# EAGLE design Dyno CAN Backplane (EAGLE 5.12)
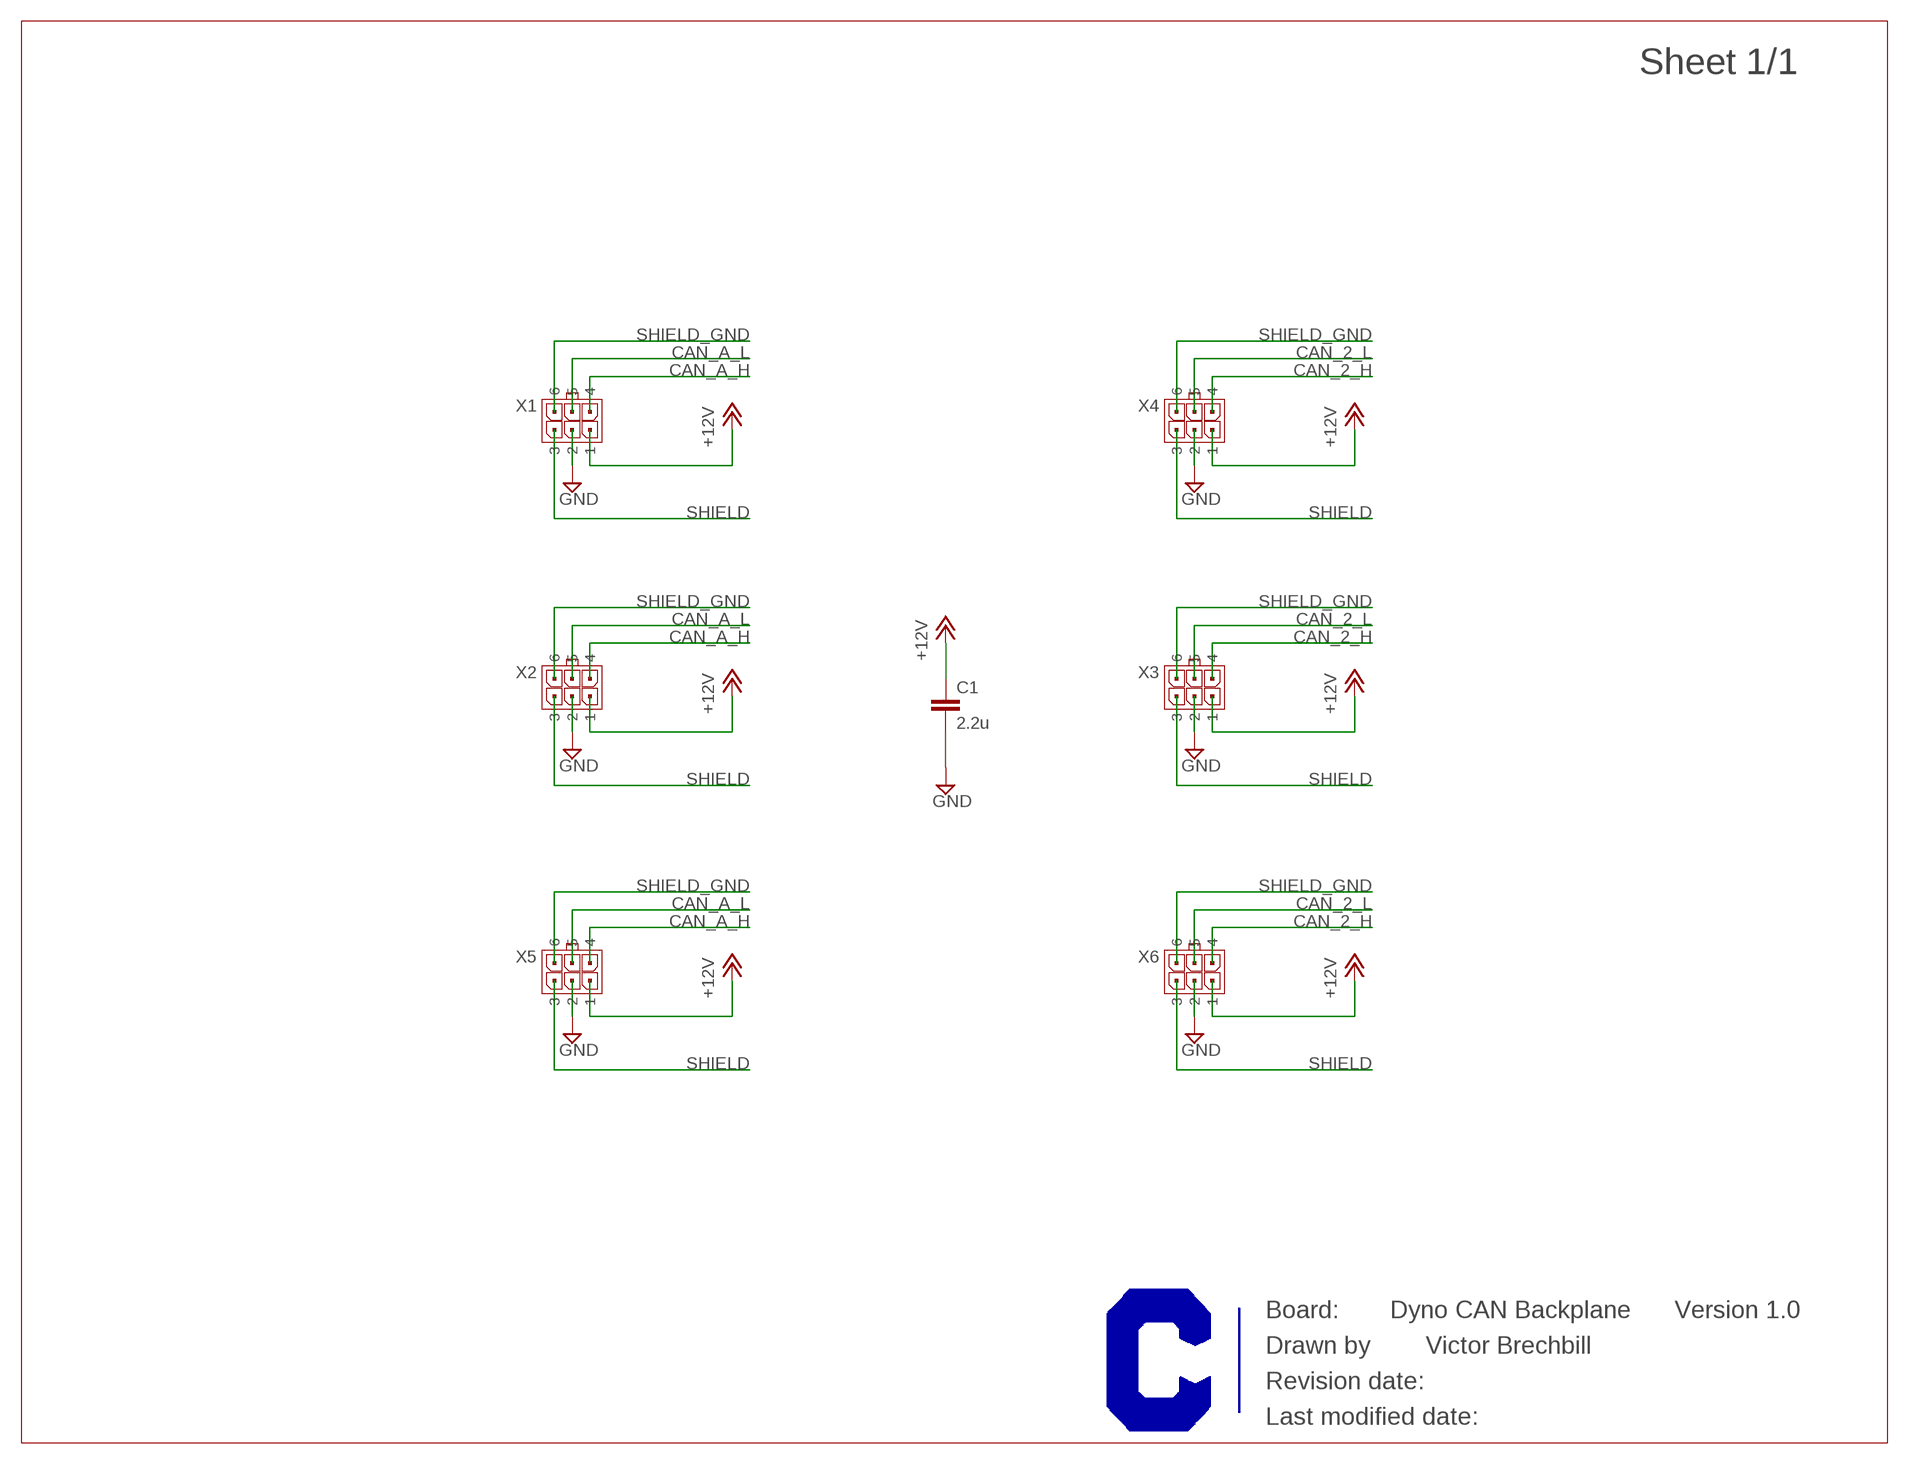
[diagram p0: schematic, sheet 1]

## Parts
C1  2.2u  CAP0603-CAP  [0603-CAP]
U$1  CURRENT-C-LETTER-LANDSCAPE  [BLANK]
X1  MICROFIT-06-DUAL-RA-SMD  [MICROFIT-6-DUAL-RA-SMD]
X2  MICROFIT-06-DUAL-RA-SMD  [MICROFIT-6-DUAL-RA-SMD]
X3  MICROFIT-06-DUAL-RA-SMD  [MICROFIT-6-DUAL-RA-SMD]
X4  MICROFIT-06-DUAL-RA-SMD  [MICROFIT-6-DUAL-RA-SMD]
X5  MICROFIT-06-DUAL-RA-SMD  [MICROFIT-6-DUAL-RA-SMD]
X6  MICROFIT-06-DUAL-RA-SMD  [MICROFIT-6-DUAL-RA-SMD]

## Nets
+12V: C1.1 X1.1 X2.1 X3.1 X4.1 X5.1 X6.1
CAN_2_H: X3.4 X4.4 X6.4
CAN_2_L: X3.5 X4.5 X6.5
CAN_A_H: X1.4 X2.4 X5.4
CAN_A_L: X1.5 X2.5 X5.5
GND: C1.2 X1.2 X1.6 X2.2 X2.6 X3.2 X3.6 X4.2 X4.6 X5.2 X5.6 X6.2 X6.6
SHIELD: X1.3 X2.3 X3.3 X4.3 X5.3 X6.3

## Notes on the sheet
- SHIELD_GND | SHIELD_GND
- SHIELD_GND | SHIELD_GND
- SHIELD_GND | SHIELD_GND
- Dyno CAN Backplane | Version 1.0
- Victor Brechbill

## Library data of the parts
C1 = SparkFun:CAP: Capacitor Standard 0603 ceramic capacitor, and 0.1" leaded capacitor.
U$1 = Frames:CURRENT-C-LETTER-LANDSCAPE; BOM: EXCLUDE
X1-X6 = Molex:MICROFIT-06-DUAL: Molex MicroFit 3.00mm Pitch Header, Surface Mount, Dual Row, 6 Circuits Note, November 2014: These come in three styles: Through-hole, with metal clip retention to PCB (not currently represented) (cheapest) SMD, with solder tab retention (-SMD) (more expensive, commonly stocked) SMD, with metal clip retention (-SMD-CLIP_RETENTION) (most expensive, not often stocked) Please use them in that order! Drawing: http://www.molex.com/pdm_docs/sd/430450609_sd.pdf (right-angle) Information: http://www.molex.com/molex/products/datasheet.jsp?part=active/0430450618_PCB_HEADERS.xml; PARTNO: 43045-0609

## Board
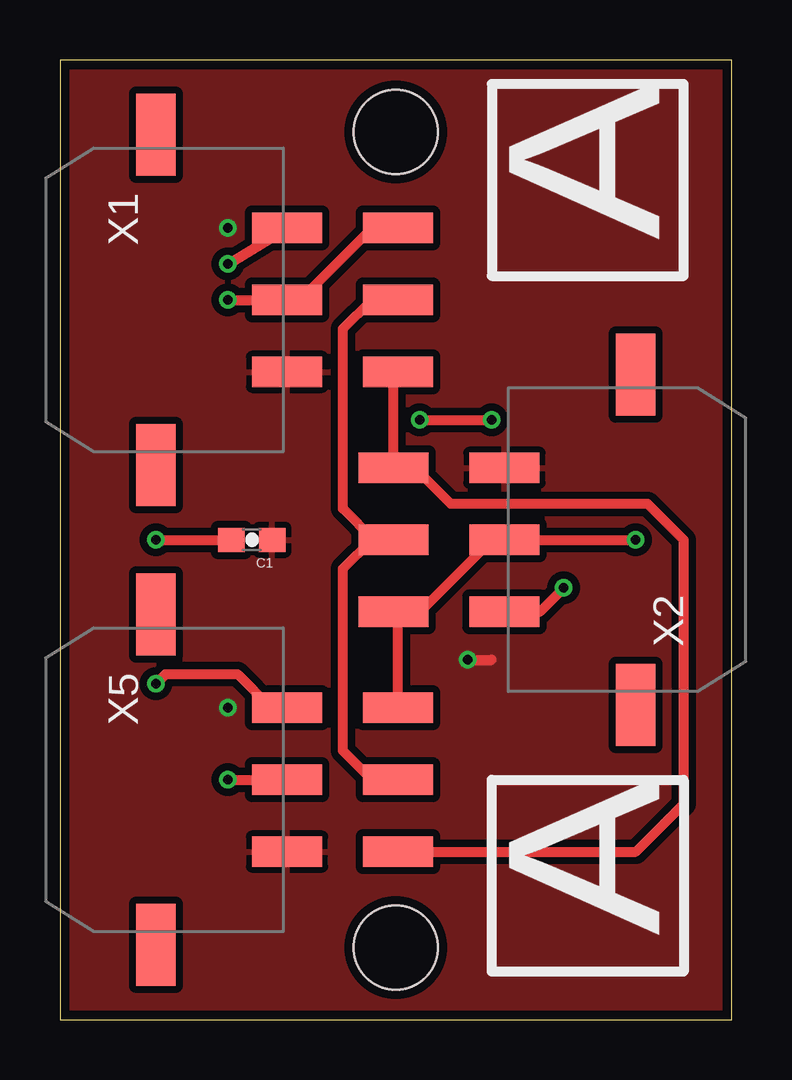
[diagram p1: board, top side]
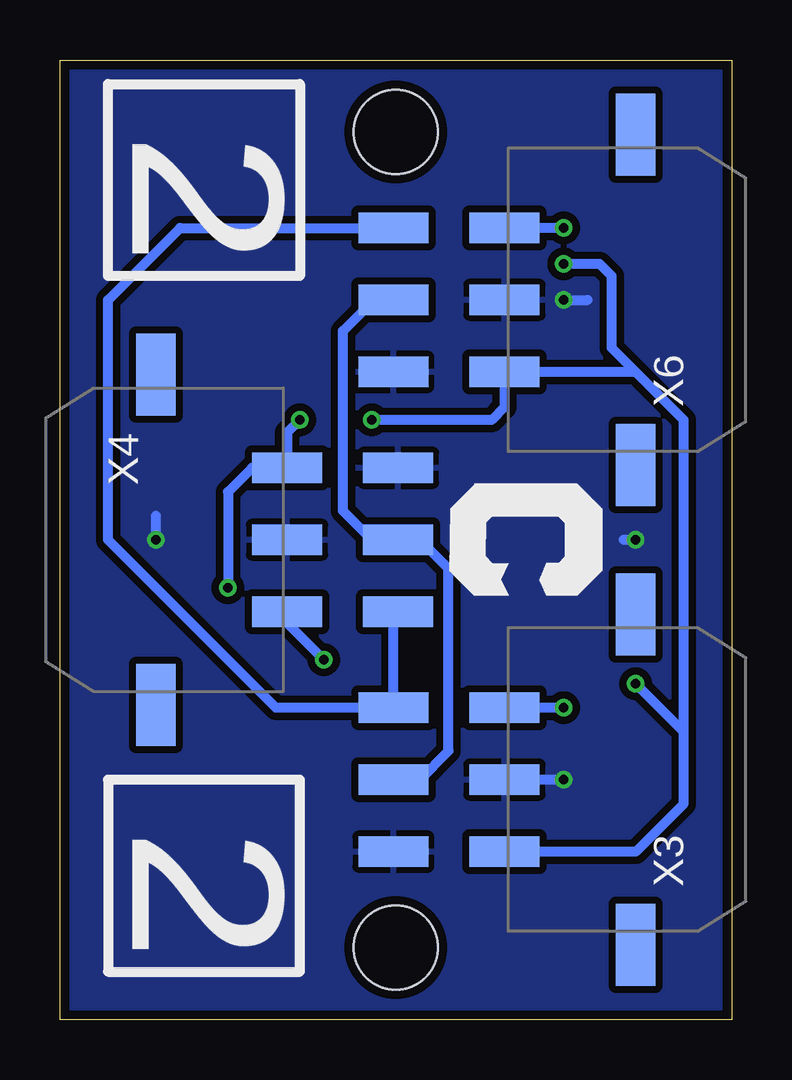
[diagram p2: board, bottom side, seen from below]

Size 28 x 40 mm. Coordinates in mm from the lower left corner, seen from the top.
Outline: 0,0 28,0 28,40 0,40 0,0
Copper layers (1*16): Top 0.0356mm / dielectric 1.5011mm / Bottom 0.0356mm
Design rules "OSH Park 2-layer": minimum track width 6mil, minimum drill 13mil, track to track 6mil, track to pad 6mil, pad to pad 6mil, via to via 6mil, smd to smd 6mil, copper to edge 15mil, drill to drill 6mil, minimum pad ring 7mil, minimum via ring 7mil, stop-mask expansion 4mil, vias tented up to drill 0mil, thermal gap 10mil
Holes 3.5 mm at 14,3 14,37

### Footprints (pad centres in the part's own frame; a part is rotated, then mirrored left to right if it is on the bottom)
0603-CAP = smd 1.1 x 1: 1 -0.85,0; 2 0.85,0
MICROFIT-6-DUAL-RA-SMD = smd 1.27 x 2.921: 1 3,5.47; 2 0,5.47; 3 -3,5.47; 4 3,10.1; 5 0,10.1; 6 -3,10.1 | smd 3.429 x 1.651: P$9 6.883,0; P$10 -6.883,0

### Placement (x,y rotation side)
C1  8,20 180 top
U$1  -54.61,35.56 0 top  (outside the outline)
X1  4,30 270 top
X2  24,20 90 top
X3  4,10 90 bottom
X4  24,20 270 bottom
X5  4,10 270 top
X6  4,30 90 bottom

### Tracks (layer width: path | path; a pad name or v marks a point on that pad's centre or on a via)
+12V  (via drill 0.38)
  Top 0.406: v17,15 18,15
  Bottom 0.406: X4.1 18.53,16.53 v17,15 | v7,13 X3.1 | v7,33 X6.1
  pour Top (isolate 0.305): 0,40 28,40 28,0 0,0
CAN_2_H
  Bottom 0.406: X4.4 14.1,16.8 X3.4 19,13 26,20 26,30 23,33 X6.4
CAN_2_L
  Bottom 0.406: 15.3,10 X3.5 13,10 11.8,11.2 11.8,18.8 13,20 X4.5 15,20 16.2,21.2 16.2,28.7 14.9,30 X6.5
CAN_A_H
  Top 0.406: X1.4 13.9,26.8 X2.4 14.8,23 16.3,21.5 24.5,21.5 26,20 26,9 24,7 X5.4
CAN_A_L
  Top 0.406: X1.5 13,30 11.8,28.8 11.8,21.3 13.1,20 X2.5 13,20 11.8,18.8 11.8,11.2 13,10 X5.5
GND  (via drill 0.38)
  Top 0.406: X1.6 13,33 10,30 X6.2 v7,30 | X5.6 14.1,16.8 X2.6 15,17 18,20 X2.2 v24,20 | v7,10 X5.2 | v4,20 C1.2
  Bottom 0.406: v7,30 6,30 | v24,20 24,21 | v7,10 8,10 | v4,20 4.5,20
  pour Bottom (isolate 0.305): 0,40 28,40 28,0 0,0
SHIELD  (via drill 0.38)
  Top 0.406: v7,31.5 X1.3 | v15,25 v18,25 | X2.3 20,17 v21,18 | X5.3 8.8,13 7.4,14.4 4.4,14.4 v4,14
  Bottom 0.406: 4,27 X6.3 9.47,25.53 10,25 v15,25 | 4,27 2,25 2,12 | X3.3 4,7 2,9 2,12 | v18,25 18.53,24.47 X4.3 20,23 21,22 v21,18 | v7,31.5 5.5,31.5 5,31 5,28 4,27 | 2,12 v4,14

### Text on the board
_tsilk: A | A
_bsilk: 2 | 2